# EAGLE schematic *Gas (EAGLE 7.2.0)
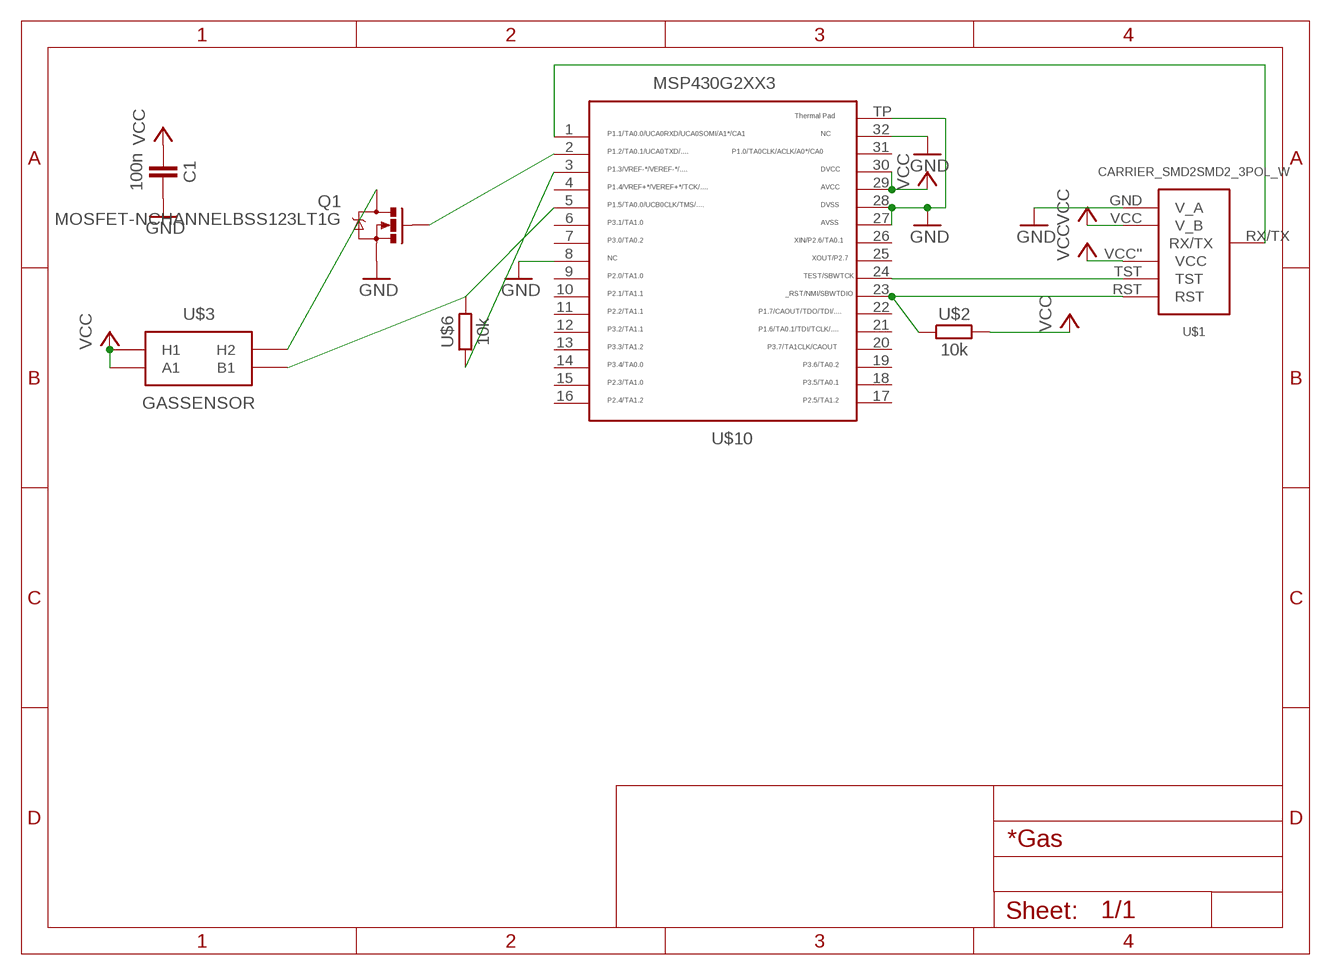
[diagram p0: schematic, sheet 1]

## Parts
C1  100n  CAPACITOR  [603]
Q1  MOSFET-NCHANNELBSS123LT1G  [SOT23-3]
U$1  CARRIER_SMD2SMD2_3POL_W  [CARRIER_SMD2_WIDE_3POL]
U$2  10k  RESISTOR0603  [603]
U$3  GASSENSOR  [GASSENSOR]
U$6  10k  RESISTOR0603  [603]
U$10  MSP430G2553  [QFN32]

## Nets
GND: C1.2 Q1.2(S) U$1.GND(V_A) U$10.8 U$10.27 U$10.28 U$10.32 U$10.TP
N$2: Q1.1(G) U$10.2
N$3: U$1.TST U$10.24
N$4: U$1.RST U$2.1 U$10.23
N$5: Q1.3(D) U$3.PHB(H2)
N$6: U$6.1 U$10.3
N$12: U$1.RX/TX U$10.1
N$14: U$3.PB1(B1) U$6.2 U$10.5
VCC: C1.1 U$1.VCC''(VCC) U$1.VCC(V_B) U$2.2 U$3.PA1(A1) U$3.PHA(H1) U$10.29 U$10.30
Unconnected: U$10.4 U$10.6 U$10.7 U$10.9 U$10.10 U$10.11 U$10.12 U$10.13 U$10.14 U$10.15 U$10.16 U$10.17 U$10.18 U$10.19 U$10.20 U$10.21 U$10.22 U$10.25 U$10.26 U$10.31

## Library data of the parts
C1 = thar:CAPACITOR
Q1 = SparkFun-DiscreteSemi:MOSFET-NCHANNEL: Common NMOSFET Parts MFG P/N Store ID Prod ID FDD8780 TRANS-09984 SI7820DN TRANS-11055 FDS6630A IC-08089 2N7002PW TRANS-11151 FQP30N06L COM-10213 TRANS-10060 BSS123LT1G TRANS-08345 BSS138 TRANS-00830 BS170 2N7000; PROD_ID: TRANS-08345
U$1 = thar:CARRIER_SMD2
U$2 U$6 = thar:RESISTOR
U$3 = thar:GASSENSOR: MQ-135 Luft Qualität Gefährliche Gas Sensor Modul 10-1000ppm Arduino SE03135 Bezug: Ebay-Eckstein <http://stores.ebay.de/ecksteinkomponente/>
U$10 = thar:MSP430G2553: TEXAS INSTRUMENTS MSP430G2553IRHB32R MCU, 16BIT, MSP430, 16MHZ, QFN-32 Farnell Best.Nr.: 2325726 Herst.Bez.: MSP430G2553IRHB32R